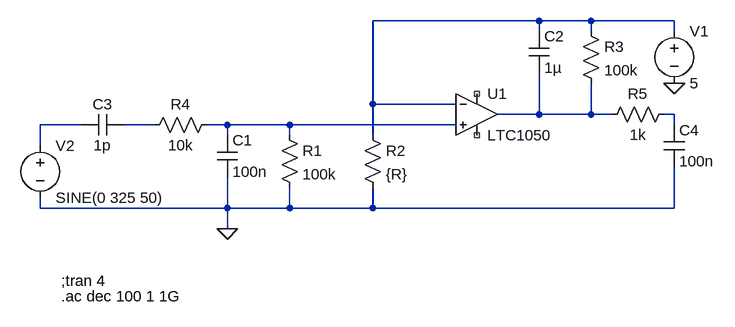
[diagram p0: schematic AMPLIF.asc]
AMPLIF.asc, the LTspice schematic file:
Version 4
SHEET 1 920 680
WIRE 576 -48 320 -48
WIRE 656 -48 576 -48
WIRE 784 -48 656 -48
WIRE 576 -32 576 -48
WIRE 656 -32 656 -48
WIRE 784 -32 784 -48
WIRE 320 80 320 -48
WIRE 448 80 320 80
WIRE 576 96 576 32
WIRE 576 96 512 96
WIRE 656 96 656 48
WIRE 656 96 576 96
WIRE 688 96 656 96
WIRE 784 96 768 96
WIRE -128 112 -192 112
WIRE -16 112 -64 112
WIRE 96 112 64 112
WIRE 192 112 96 112
WIRE 448 112 192 112
WIRE 784 112 784 96
WIRE 96 128 96 112
WIRE 192 128 192 112
WIRE 320 128 320 80
WIRE -192 144 -192 112
WIRE -192 240 -192 224
WIRE 96 240 96 192
WIRE 96 240 -192 240
WIRE 192 240 192 208
WIRE 192 240 96 240
WIRE 320 240 320 208
WIRE 320 240 192 240
WIRE 784 240 784 176
WIRE 784 240 320 240
WIRE 96 272 96 240
FLAG 96 272 0
FLAG 784 48 0
SYMBOL res 176 112 R0
SYMATTR InstName R1
SYMATTR Value 100k
SYMBOL cap 80 128 R0
SYMATTR InstName C1
SYMATTR Value 100n
SYMBOL res 304 112 R0
SYMATTR InstName R2
SYMATTR Value {R}
SYMBOL res 640 -48 R0
SYMATTR InstName R3
SYMATTR Value 100k
SYMBOL res 80 96 R90
WINDOW 0 0 56 VBottom 2
WINDOW 3 32 56 VTop 2
SYMATTR InstName R4
SYMATTR Value 10k
SYMBOL cap 560 -32 R0
SYMATTR InstName C2
SYMATTR Value 1µ
SYMBOL cap -64 96 R90
WINDOW 0 0 32 VBottom 2
WINDOW 3 32 32 VTop 2
SYMATTR InstName C3
SYMATTR Value 1p
SYMBOL OpAmps\\LTC1050 480 32 R0
SYMATTR InstName U1
SYMBOL cap 768 112 R0
SYMATTR InstName C4
SYMATTR Value 100n
SYMBOL res 784 80 R90
WINDOW 0 0 56 VBottom 2
WINDOW 3 32 56 VTop 2
SYMATTR InstName R5
SYMATTR Value 1k
SYMBOL voltage 784 -48 R0
WINDOW 123 0 0 Left 0
WINDOW 39 0 0 Left 0
SYMATTR InstName V1
SYMATTR Value 5
SYMBOL voltage -192 128 R0
WINDOW 123 0 0 Left 0
WINDOW 39 0 0 Left 0
SYMATTR InstName V2
SYMATTR Value SINE(0 325 50)
TEXT -160 352 Left 2 !;tran 4
TEXT -160 376 Left 2 !.ac dec 100 1 1G

The netlist it stands for:
* AMPLIF.asc
R1 N006 0 100k
C1 N006 0 100n
R2 N001 0 {R}
R3 N001 N002 100k
R4 N006 N005 10k
C2 N001 N002 1µ
C3 N005 N004 1p
XU1 N006 N001 NC_01 NC_02 N002 LTC1050  ; pins In+ In- V+ V- OUT
C4 N003 0 100n
R5 N003 N002 1k
V1 N001 0 5
V2 N004 0 SINE(0 325 50)
;tran 4
.ac dec 100 1 1G
.lib LTC.lib
.backanno
.end